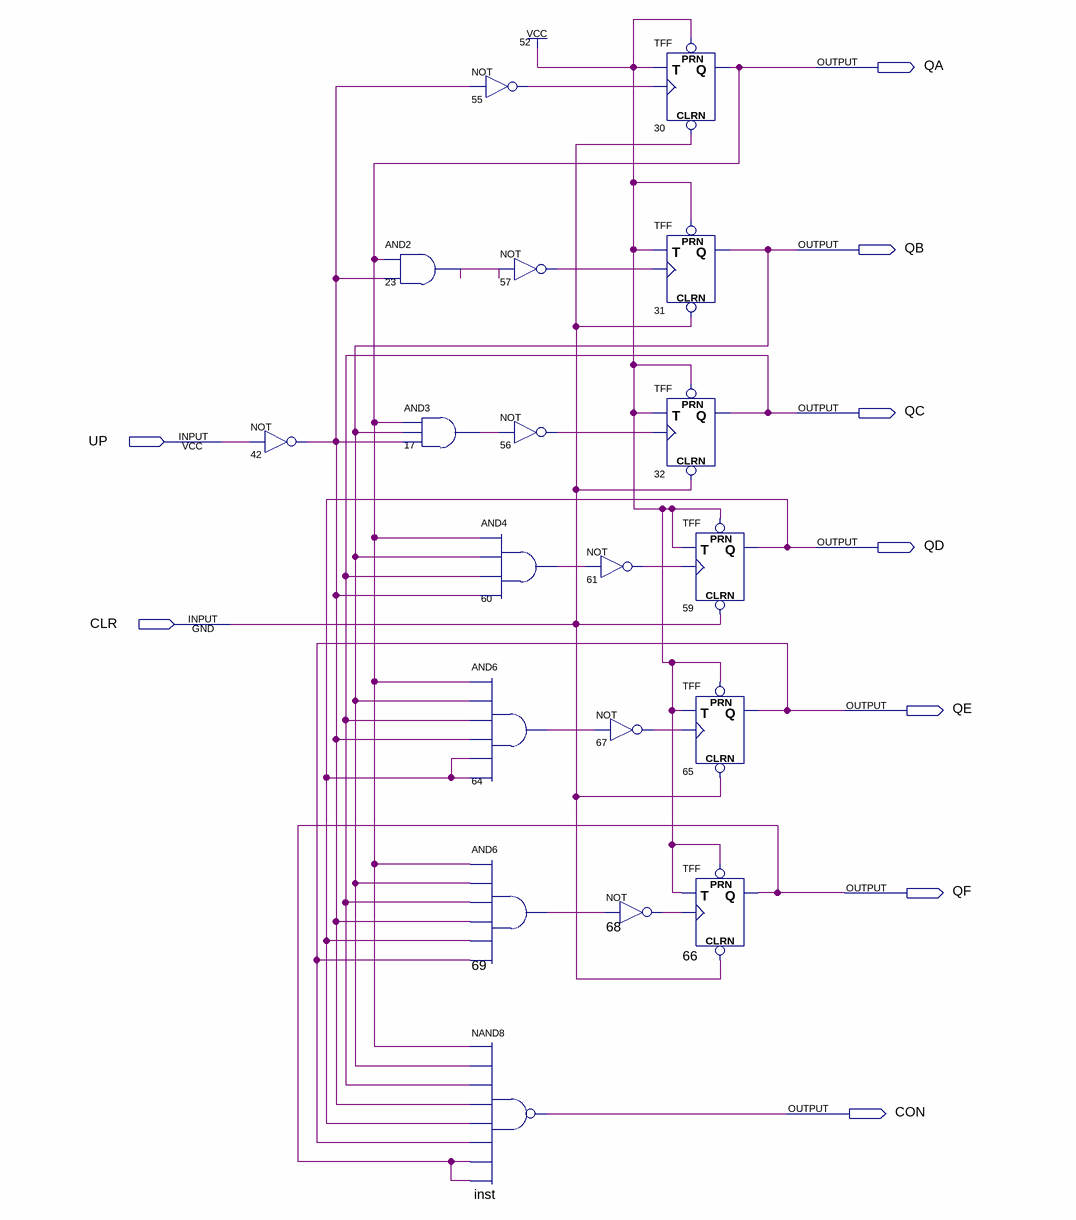
[diagram p0: schematic sheet]
// Quartus schematic count64_2018.bdf as structural Verilog: 19 symbols, 9 pins
module count64_2018 (
  input  UP,
  input  CLR,
  output QA,
  output QB,
  output QC,
  output QD,
  output QE,
  output QF,
  output CON
);

  wire n17_out, n23_out, n42_out, n55_out, n56_out, n57_out, n60_out, n61_out, n64_out, n67_out, n68_out,
       n69_out;

  not u_42 (n42_out, UP);
  and u_23 (n23_out, QA, n42_out);
  and u_17 (n17_out, QA, QB, n42_out);
  not u_55 (n55_out, n42_out);
  not u_57 (n57_out, n23_out);
  not u_56 (n56_out, n17_out);
  and u_60 (n60_out, QA, QB, QC, n42_out);
  and u_64 (n64_out, QA, QB, QC, n42_out, QD, QD);
  and u_69 (n69_out, QA, QB, QC, n42_out, QD, QE);
  nand inst (CON, QA, QB, QC, n42_out, QD, QE, QF, QF);
  not u_61 (n61_out, n60_out);
  not u_67 (n67_out, n64_out);
  not u_68 (n68_out, n69_out);
  TFF u_30 (.PRN(1'b1), .CLRN(CLR), .T(1'b1), .CLK(n55_out), .Q(QA));
  TFF u_31 (.PRN(1'b1), .CLRN(CLR), .T(1'b1), .CLK(n57_out), .Q(QB));
  TFF u_32 (.PRN(1'b1), .CLRN(CLR), .T(1'b1), .CLK(n56_out), .Q(QC));
  TFF u_59 (.PRN(1'b1), .CLRN(CLR), .T(1'b1), .CLK(n61_out), .Q(QD));
  TFF u_65 (.PRN(1'b1), .CLRN(CLR), .T(1'b1), .CLK(n67_out), .Q(QE));
  TFF u_66 (.PRN(1'b1), .CLRN(CLR), .T(1'b1), .CLK(n68_out), .Q(QF));
endmodule
